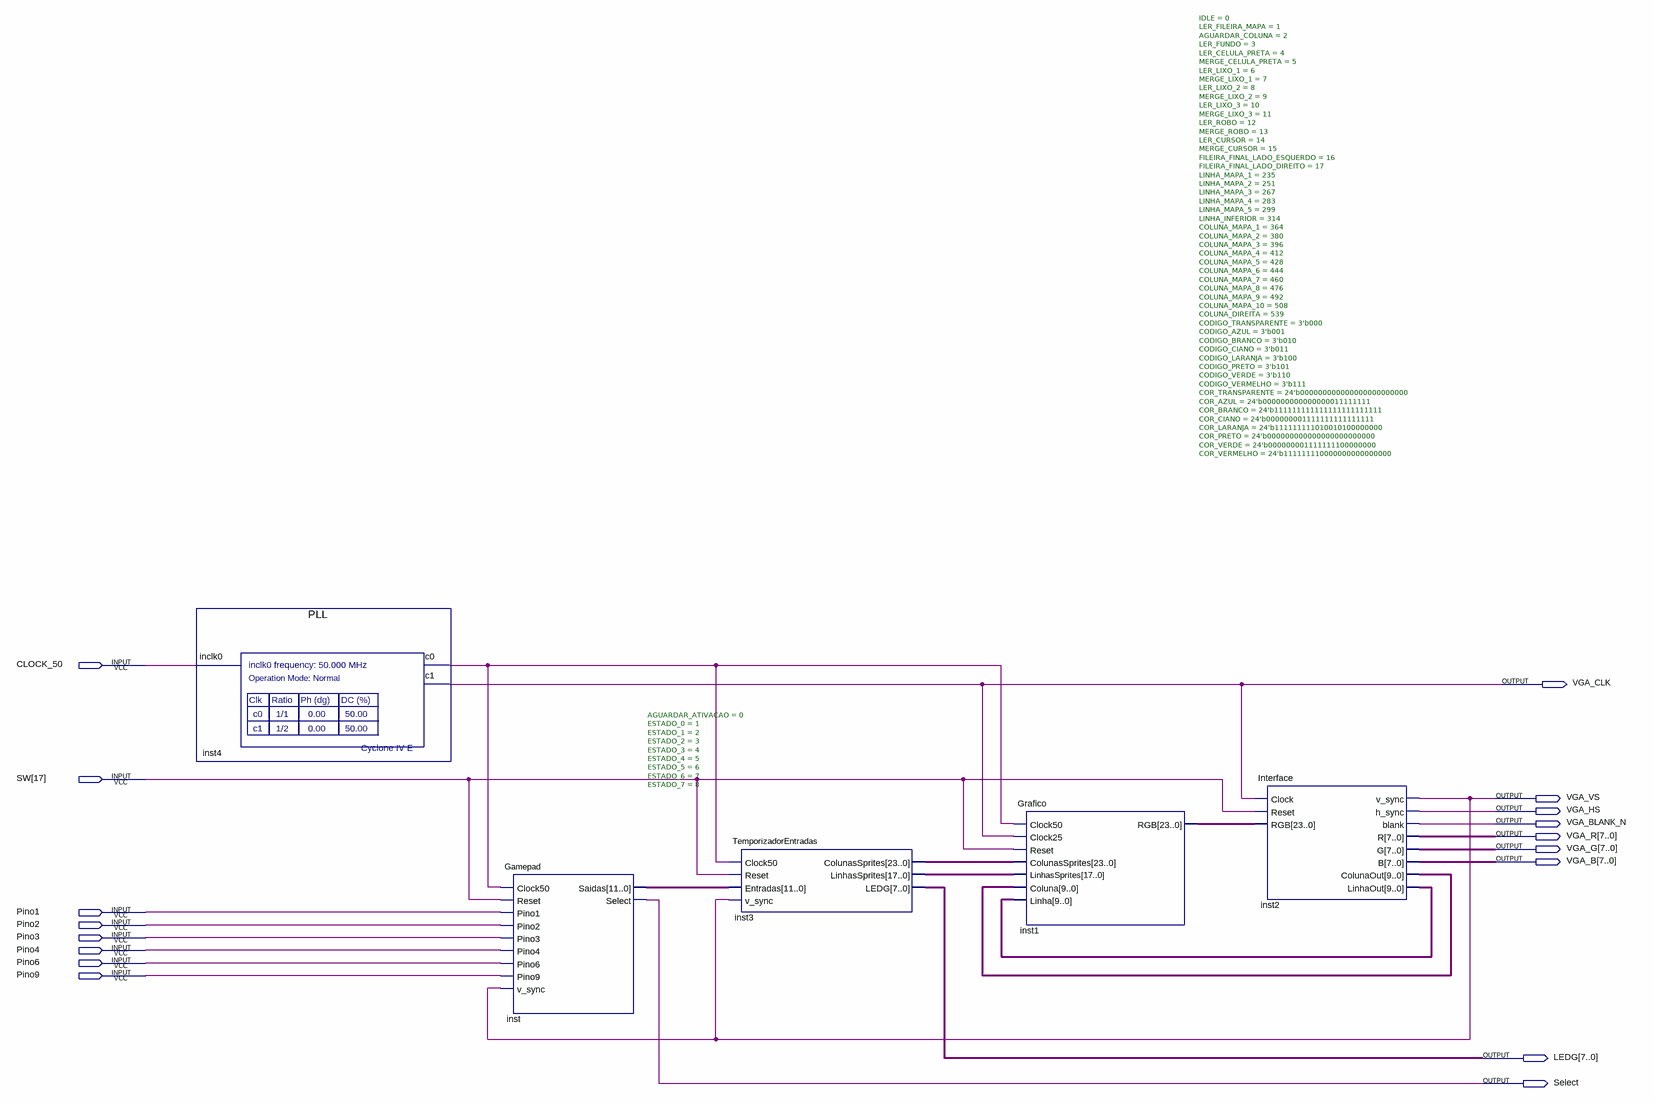
[diagram p0: schematic sheet]
// Quartus schematic Interfaces.bdf as structural Verilog: 5 symbols, 17 pins
module Interfaces (
  input  CLOCK_50,
  input  [17:17] SW,
  input  Pino1,
  input  Pino2,
  input  Pino3,
  input  Pino4,
  input  Pino6,
  input  Pino9,
  output VGA_CLK,
  output VGA_VS,
  output VGA_HS,
  output VGA_BLANK_N,
  output [7:0] VGA_R,
  output [7:0] VGA_G,
  output [7:0] VGA_B,
  output [7:0] LEDG,
  output Select
);

  wire inst4_c0;
  wire [9:0] inst2_colunaout, inst2_linhaout;
  wire [11:0] inst_saidas;
  wire [17:0] inst3_linhassprites;
  wire [23:0] inst1_rgb, inst3_colunassprites;

  PLL inst4 (.inclk0(CLOCK_50), .c0(inst4_c0), .c1(VGA_CLK));
  Gamepad #(.AGUARDAR_ATIVACAO(0), .ESTADO_0(1), .ESTADO_1(2), .ESTADO_2(3), .ESTADO_3(4), .ESTADO_4(5), .ESTADO_5(6), .ESTADO_6(7), .ESTADO_7(8)) inst (
    .Clock50(inst4_c0), .Reset(SW[17]), .Pino1(Pino1), .Pino2(Pino2), .Pino3(Pino3), .Pino4(Pino4),
    .Pino6(Pino6), .Pino9(Pino9), .v_sync(VGA_VS), .Saidas(inst_saidas), .Select(Select));
  TemporizadorEntradas inst3 (
    .Clock50(inst4_c0), .Reset(SW[17]), .Entradas(inst_saidas), .v_sync(VGA_VS),
    .ColunasSprites(inst3_colunassprites), .LinhasSprites(inst3_linhassprites), .LEDG(LEDG));
  Grafico #(.IDLE(0), .LER_FILEIRA_MAPA(1), .AGUARDAR_COLUNA(2), .LER_FUNDO(3), .LER_CELULA_PRETA(4), .MERGE_CELULA_PRETA(5), .LER_LIXO_1(6), .MERGE_LIXO_1(7), .LER_LIXO_2(8), .MERGE_LIXO_2(9), .LER_LIXO_3(10), .MERGE_LIXO_3(11), .LER_ROBO(12), .MERGE_ROBO(13), .LER_CURSOR(14), .MERGE_CURSOR(15), .FILEIRA_FINAL_LADO_ESQUERDO(16), .FILEIRA_FINAL_LADO_DIREITO(17), .LINHA_MAPA_1(235), .LINHA_MAPA_2(251), .LINHA_MAPA_3(267), .LINHA_MAPA_4(283), .LINHA_MAPA_5(299), .LINHA_INFERIOR(314), .COLUNA_MAPA_1(364), .COLUNA_MAPA_2(380), .COLUNA_MAPA_3(396), .COLUNA_MAPA_4(412), .COLUNA_MAPA_5(428), .COLUNA_MAPA_6(444), .COLUNA_MAPA_7(460), .COLUNA_MAPA_8(476), .COLUNA_MAPA_9(492), .COLUNA_MAPA_10(508), .COLUNA_DIREITA(539), .CODIGO_TRANSPARENTE(3'b000), .CODIGO_AZUL(3'b001), .CODIGO_BRANCO(3'b010), .CODIGO_CIANO(3'b011), .CODIGO_LARANJA(3'b100), .CODIGO_PRETO(3'b101), .CODIGO_VERDE(3'b110), .CODIGO_VERMELHO(3'b111), .COR_TRANSPARENTE(24'b000000000000000000000000), .COR_AZUL(24'b000000000000000011111111), .COR_BRANCO(24'b111111111111111111111111), .COR_CIANO(24'b000000001111111111111111), .COR_LARANJA(24'b111111111010010100000000), .COR_PRETO(24'b000000000000000000000000), .COR_VERDE(24'b000000001111111100000000), .COR_VERMELHO(24'b111111110000000000000000)) inst1 (
    .Clock50(inst4_c0), .Clock25(VGA_CLK), .Reset(SW[17]), .ColunasSprites(inst3_colunassprites),
    .LinhasSprites(inst3_linhassprites), .Coluna(inst2_colunaout), .Linha(inst2_linhaout), .RGB(inst1_rgb));
  Interface inst2 (
    .Clock(VGA_CLK), .Reset(SW[17]), .RGB(inst1_rgb), .v_sync(VGA_VS), .h_sync(VGA_HS), .blank(VGA_BLANK_N),
    .R(VGA_R), .G(VGA_G), .B(VGA_B), .ColunaOut(inst2_colunaout), .LinhaOut(inst2_linhaout));
endmodule
